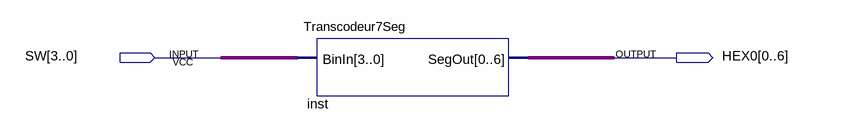
[diagram p0: schematic sheet]
// Quartus schematic Transcodeur7Seg_test.bdf as structural Verilog: 1 symbols, 2 pins
module Transcodeur7Seg_test (
  input  [3:0] SW,
  output [0:6] HEX0
);

  Transcodeur7Seg inst (.BinIn(SW), .SegOut(HEX0));
endmodule
